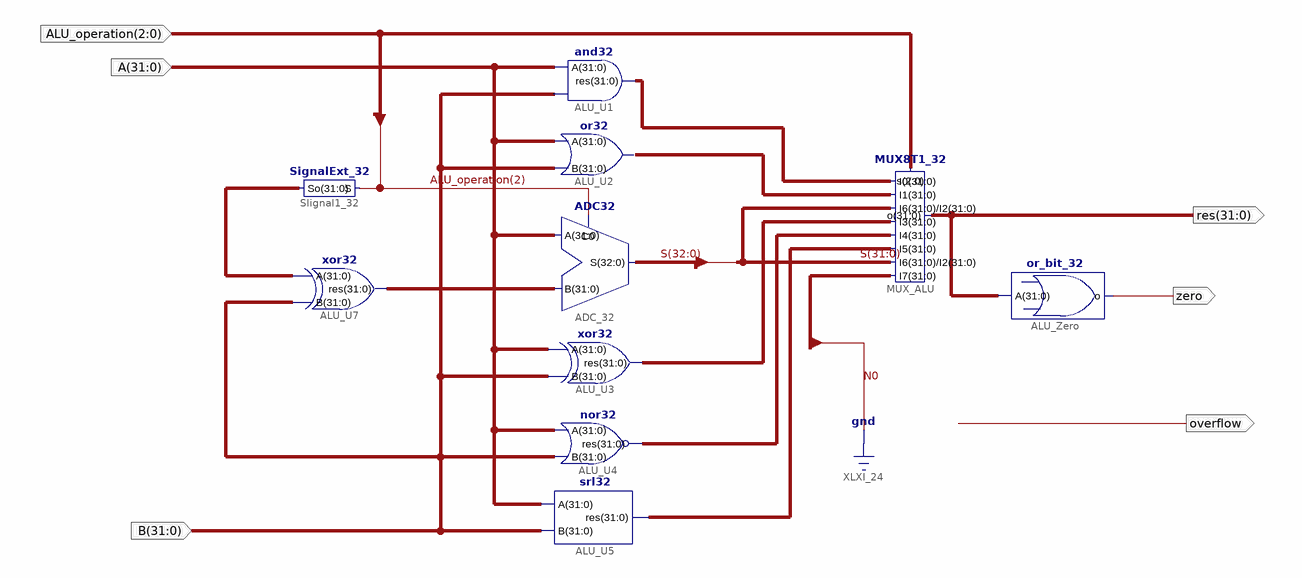
[diagram p0: schematic sheet 1]
// Xilinx ISE schematic ALU.sch (kintex7) as structural Verilog: 10 symbols, 6 ports
module ALU (
  input  [2:0] ALU_operation,
  input  [31:0] A,
  input  [31:0] B,
  output [31:0] res,
  output zero,
  output overflow
);

  wire [31:0] XLXN_1, XLXN_2, XLXN_8, XLXN_9, XLXN_10, XLXN_36, XLXN_37;
  wire [32:0] S;

  and32 ALU_U1 (.res(XLXN_1), .A(A), .B(B));
  or32 ALU_U2 (.A(A), .B(B));  // open: res
  ADC32 ADC_32 (.B(XLXN_36), .A(A), .C0(ALU_operation[2]), .S(S));
  xor32 ALU_U3 (.A(A), .B(B), .res(XLXN_8));
  nor32 ALU_U4 (.res(XLXN_9), .A(A), .B(B));
  srl32 ALU_U5 (.A(A), .B(B), .res(XLXN_10));
  MUX8T1_32 MUX_ALU (
    .s(ALU_operation), .I7({{31{1'b0}}, S[32]}), .I6(S[31:0]), .I5(XLXN_10), .I4(XLXN_9), .I3(XLXN_8),
    .I2(S[31:0]), .I1(XLXN_2), .I0(XLXN_1), .o(res));
  or_bit_32 ALU_Zero (.o(zero), .A(res));
  xor32 ALU_U7 (.A(XLXN_37), .B(B), .res(XLXN_36));
  SignalExt_32 Slignal1_32 (.S(ALU_operation[2]), .So(XLXN_37));
endmodule
